# Altium schematic sheet etf_pwr.SchDoc
size A4; SheetNumber: 3; SheetTotal: 5
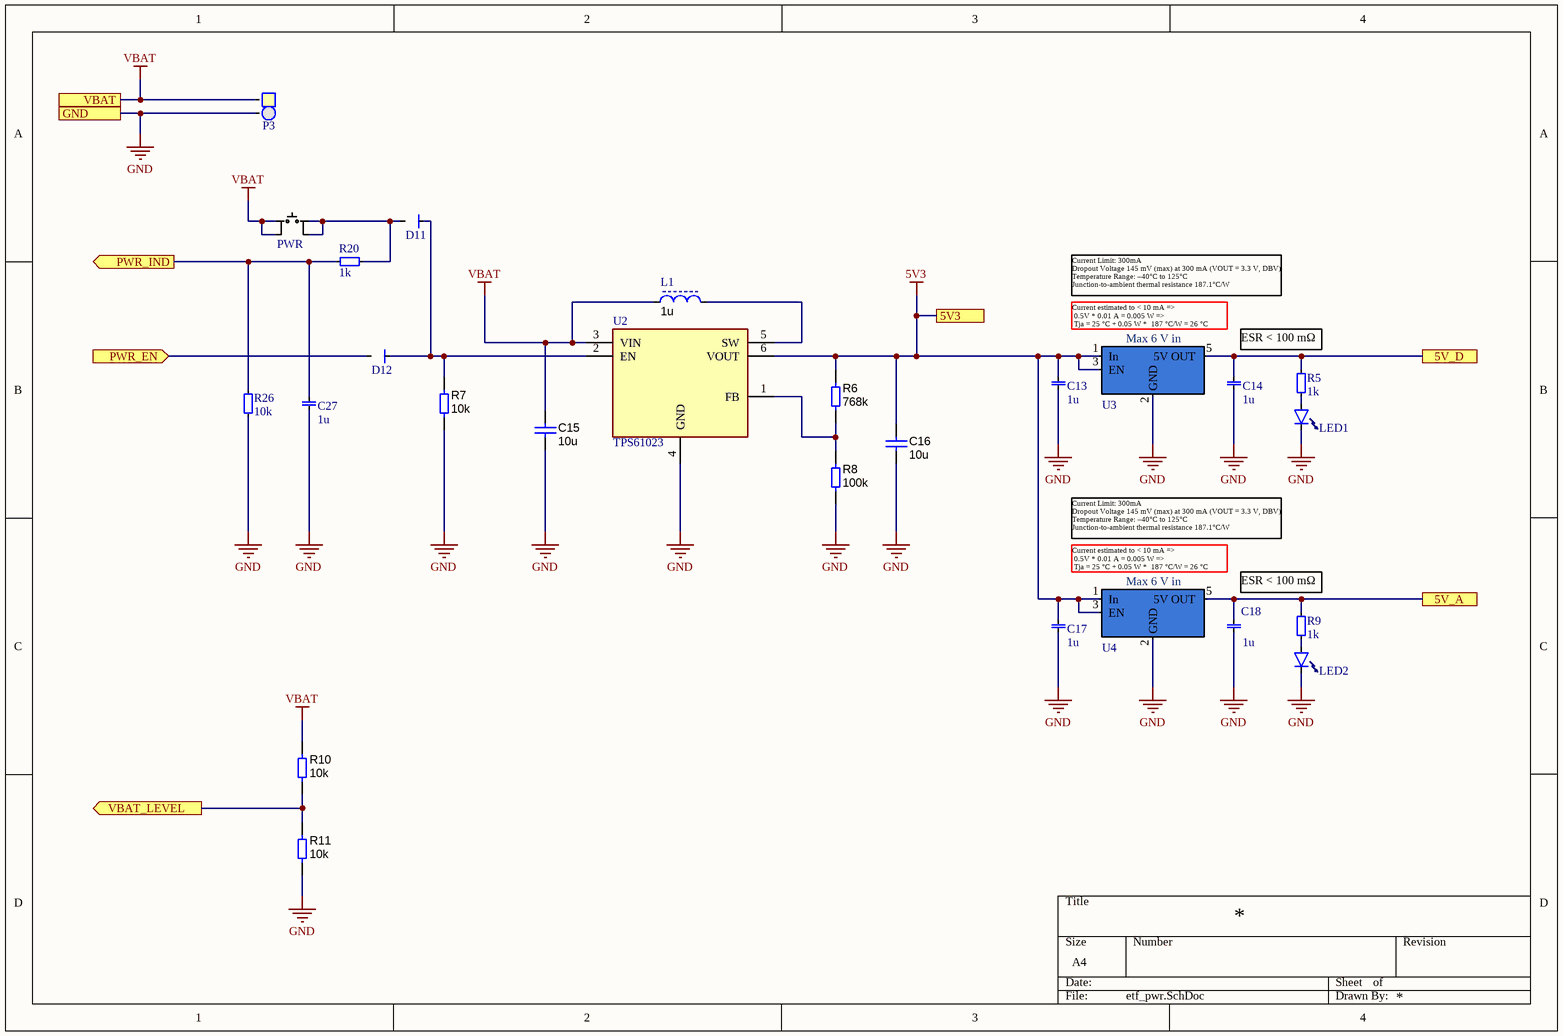
[diagram p0: etf_pwr.SchDoc]

## Parts
C13  value 1u  [0603 cap]  (hidden comment: 0603, capacitor)
C14  value 1u  [0603 cap]  (hidden comment: 0603, capacitor)
C15  value 10u  [1206_180]  (hidden comment: CAP, 1206)
C16  value 10u  [1206_180]  (hidden comment: CAP, 1206)
C17  value 1u  [0603 cap]  (hidden comment: 0603, capacitor)
C18  value 1u  [0603 cap]  (hidden comment: 0603, capacitor)
C27  value 1u  [0603 cap]  (hidden comment: 0603, capacitor)
D11  Diode, SMD  [SOD323]  (value not drawn)
D12  Diode, SMD  [SOD323]  (value not drawn)
L1  value 1u  [XEL4030-102MEC]  (hidden comment: Inductor, 1616)
LED1  0805, LED  [0805_led]  (value not drawn)
LED2  0805, LED  [0805_led]  (value not drawn)
P3  1x2 Pin Header  [padtwo_L]  (value not drawn)
PWR  Tactile Button  [SW_TS02-66-150-BK-160-LCR-D]  (value not drawn)
R5  value 1k  [0603]  (hidden comment: 0603, resistor)
R6  value 768k  [0603]  (hidden comment: RES, 0603)
R7  value 10k  [0603]  (hidden comment: RES, 0603)
R8  value 100k  [0603]  (hidden comment: RES, 0603)
R9  value 1k  [0603]  (hidden comment: 0603, resistor)
R10  value 10k  [0603]  (hidden comment: RES, 0603)
R11  value 10k  [0603]  (hidden comment: RES, 0603)
R20  value 1k  [0603]  (hidden comment: 0603, resistor)
R26  value 10k  [0603]  (hidden comment: 0603, resistor)
U2  TPS61023  [SOT50P160X60-6N]
U3  TPS7A20  [SOT23-5]  (value not drawn)
U4  TPS7A20  [SOT23-5]  (value not drawn)

## Ports
5V3, 5V_A, 5V_D, GND, PWR_EN (in), PWR_IND (out), VBAT, VBAT_LEVEL (out)

## Nets
5V3: C13.1 C16.1 C17.1 R6.2 U2.6(VOUT) U3.1(In) U3.3(EN) U4.1(In) U4.3(EN) ; port 5V3
GND: C13.0 C14.0 C15.2 C16.2 C17.0 C18.0 C27.0 LED1.0(Cathode) LED2.0(Cathode) P3.2 R7.1 R8.1 R11.1 R26.0 U2.4(GND) U3.2(GND) U4.2(GND) ; port GND
VBAT: C15.1 L1.2 P3.1 PWR.3 PWR.4 R10.2 U2.3(VIN) ; port VBAT
5V_A: C18.1 R9.1 U4.5(5V_OUT) ; port 5V_A
5V_D: C14.1 R5.1 U3.5(5V_OUT) ; port 5V_D
PWR_EN: D12.2 ; port PWR_EN
PWR_IND: C27.1 R20.0 R26.1 ; port PWR_IND
VBAT_LEVEL: R10.1 R11.2 ; port VBAT_LEVEL
NetD11_1: D11.1 D12.1 R7.2 U2.2(EN)
NetD11_2: D11.2 PWR.1 PWR.2 R20.1
NetL1_1: L1.1 U2.5(SW)
NetLED1_1: LED1.1 R5.0
NetLED2_1: LED2.1 R9.0
NetR6_1: R6.1 R8.2 U2.1(FB)

## Notes on the sheet
- Current Limit: 300mA
  Dropout Voltage 145 mV (max) at 300 mA (VOUT = 3.3 V, DBV)
  Temperature Range: –40°C to 125°C
  Junction-to-ambient thermal resistance 187.1°C/W
- (near U3) Current estimated to < 10 mA =>
  0.5V * 0.01 A = 0.005 W =>
  Tja = 25 °C + 0.05 W *  187 °C/W = 26 °C
- ESR < 100 mΩ
- (near U4) Current estimated to < 10 mA =>
  0.5V * 0.01 A = 0.005 W =>
  Tja = 25 °C + 0.05 W *  187 °C/W = 26 °C
- (in symbol TPS7A20) Max 6 V in

## Library data of the parts
C13 C14 C17 C18 C27 = 0603, capacitor: Manufacturer Part Number: GRM188R61H105KAALD; JLCPCB Part #: C77386; Mount: Yes
C15 C16 = CAP, 1206: Manufacturer Part Number: C3216X7R1C106KT000N; JLCPCB Part #: C342827; Mount: Yes
D11 D12 = Diode, SMD: Manufacturer Part Number: BAT760,115; JLCPCB Part #: C117941; Mount: Yes
L1 = Inductor, 1616: Shielded Power Inductor with Ferrite Core; Manufacturer Part Number: SRN4018BTA-1R0Y; AC Current: 1; Mount: No; DC Resistance: 1; JLCPCB Part #: C19947630
LED1 LED2 = 0805, LED: Manufacturer Part Number: KP-2012SURCK; Value: 0805 LED; JLCPCB Part #: C2295; Mount: Yes
P3 = 1x2 Pin Header: 2.54 mm, TH; Mount: No; Value: 1x2 Pin Header
PWR = TacButton TH: Tactile Switch Small Low; Mount: No; Value: Button
R5 R9 R20 = 0603, resistor: Manufacturer Part Number: CR0603-FX-1001ELF; JLCPCB Part #: C21190; Mount: Yes
R6 = RES, 0603: Manufacturer Part Number: CR0603F768KP05Z; JLCPCB Part #: C2933258; Mount: Yes
R7 R10 R11 = RES, 0603: Manufacturer Part Number: RC0603FR-0710KL; JLCPCB Part #: C98220; Mount: Yes
R8 = RES, 0603: Manufacturer Part Number: RC0603FR-07100KL; JLCPCB Part #: C14675; Mount: Yes
R26 = 0603, resistor: Manufacturer Part Number: RC0603FR-0710KL; JLCPCB Part #: C98220; Mount: Yes
U2 = TPS61023: TPS61023 3.7-A Boost Converter with 0.5-V Ultra-low Input Voltage; Manufacturer Part Number: TPS61023DRLR; JLCPCB Part #: C919459; Mount: Yes
U3 U4 = TPS7A20: 5V and 300-mA, Ultra-Low-Noise, Low-IQ, High PSRR LDO; Manufacturer Part Number: TPS7A2045PDBVR; JLCPCB Part #: C2873627; Mount: Yes